# Altium schematic sheet Conn4&3.SchDoc
size A
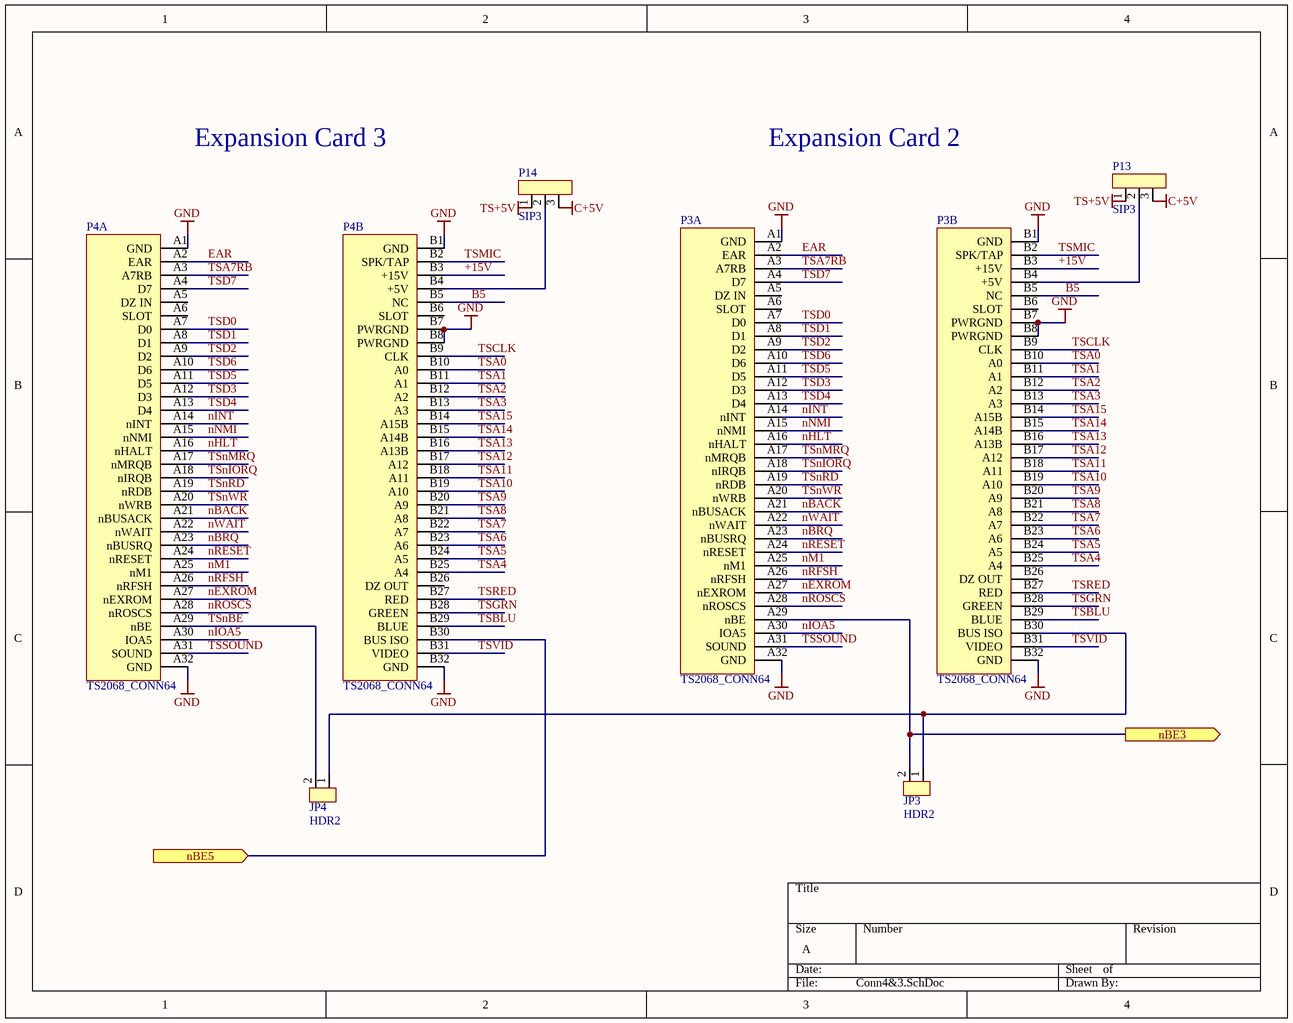
[diagram p0: Conn4&3.SchDoc]

## Parts
JP3  HDR2  [HDR2]
JP4  HDR2  [HDR2]
P3  TS2068_CONN64  [64CARDEDGE]  (parts A,B of 2)
P4  TS2068_CONN64  [64CARDEDGE]  (parts A,B of 2)
P13  SIP3  [SIP3]
P14  SIP3  [SIP3]

## Ports
nBE3 (out), nBE5 (in)

## Nets
C+5V: P13.3 P14.3
GND: P3.A1(GND) P3.A32(GND) P3.B1(GND) P3.B7(PWRGND) P3.B8(PWRGND) P3.B32(GND) P4.A1(GND) P4.A32(GND) P4.B1(GND) P4.B7(PWRGND) P4.B8(PWRGND) P4.B32(GND)
TS+5V: P13.1 P14.1
+15V: P3.B3(+15V) P4.B3(+15V)
B5: P3.B5(NC) P4.B5(NC)
EAR: P3.A2(EAR) P4.A2(EAR)
nBACK: P3.A21(nBUSACK) P4.A21(nBUSACK)
nBE3: JP3.2 P3.A29(nBE) ; port nBE3
nBE5: P4.B30(BUS_ISO) ; port nBE5
nBRQ: P3.A23(nBUSRQ) P4.A23(nBUSRQ)
nEXROM: P3.A27(nEXROM) P4.A27(nEXROM)
nHLT: P3.A16(nHALT) P4.A16(nHALT)
nINT: P3.A14(nINT) P4.A14(nINT)
nIOA5: P3.A30(IOA5) P4.A30(IOA5)
nM1: P3.A25(nM1) P4.A25(nM1)
nNMI: P3.A15(nNMI) P4.A15(nNMI)
nRESET: P3.A24(nRESET) P4.A24(nRESET)
nRFSH: P3.A26(nRFSH) P4.A26(nRFSH)
nROSCS: P3.A28(nROSCS) P4.A28(nROSCS)
nWAIT: P3.A22(nWAIT) P4.A22(nWAIT)
TSA0: P3.B10(A0) P4.B10(A0)
TSA1: P3.B11(A1) P4.B11(A1)
TSA2: P3.B12(A2) P4.B12(A2)
TSA3: P3.B13(A3) P4.B13(A3)
TSA4: P3.B25(A4) P4.B25(A4)
TSA5: P3.B24(A5) P4.B24(A5)
TSA6: P3.B23(A6) P4.B23(A6)
TSA7: P3.B22(A7) P4.B22(A7)
TSA7RB: P3.A3(A7RB) P4.A3(A7RB)
TSA8: P3.B21(A8) P4.B21(A8)
TSA9: P3.B20(A9) P4.B20(A9)
TSA10: P3.B19(A10) P4.B19(A10)
TSA11: P3.B18(A11) P4.B18(A11)
TSA12: P3.B17(A12) P4.B17(A12)
TSA13: P3.B16(A13B) P4.B16(A13B)
TSA14: P3.B15(A14B) P4.B15(A14B)
TSA15: P3.B14(A15B) P4.B14(A15B)
TSBLU: P3.B29(BLUE) P4.B29(BLUE)
TSCLK: P3.B9(CLK) P4.B9(CLK)
TSD0: P3.A7(D0) P4.A7(D0)
TSD1: P3.A8(D1) P4.A8(D1)
TSD2: P3.A9(D2) P4.A9(D2)
TSD3: P3.A12(D3) P4.A12(D3)
TSD4: P3.A13(D4) P4.A13(D4)
TSD5: P3.A11(D5) P4.A11(D5)
TSD6: P3.A10(D6) P4.A10(D6)
TSD7: P3.A4(D7) P4.A4(D7)
TSGRN: P3.B28(GREEN) P4.B28(GREEN)
TSMIC: P3.B2(SPK/TAP) P4.B2(SPK/TAP)
TSnBE: JP4.2 P4.A29(nBE)
TSnIORQ: P3.A18(nIRQB) P4.A18(nIRQB)
TSnMRQ: P3.A17(nMRQB) P4.A17(nMRQB)
TSnRD: P3.A19(nRDB) P4.A19(nRDB)
TSnWR: P3.A20(nWRB) P4.A20(nWRB)
TSRED: P3.B27(RED) P4.B27(RED)
TSSOUND: P3.A31(SOUND) P4.A31(SOUND)
TSVID: P3.B31(VIDEO) P4.B31(VIDEO)
NetJP3_1: JP3.1 JP4.1 P3.B30(BUS_ISO)
NetP3_B4: P3.B4(+5V) P13.2
NetP4_B4: P4.B4(+5V) P14.2

Not connected (* = marked no-connect by the designer): P3 A5(DZ_IN) A6(SLOT) B6(SLOT) B26(DZ_OUT); P4 A5(DZ_IN) A6(SLOT) B6(SLOT) B26(DZ_OUT)

## Notes on the sheet
- Expansion Card 3
- Expansion Card 2

## Library data of the parts
P3 P4 = TS2068_CONN64: 64 Position Female Connector Non Specified - Dual Edge Gold 0.100" (2.54mm) Black; MFG: TD; MFG PN: 1761469-1; DK PN: 1761469-1-ND; FOOTPRINT: ESW-40; Populate: *